# EAGLE schematic ATTiny10ProgrammingAdapter (EAGLE 6.4)
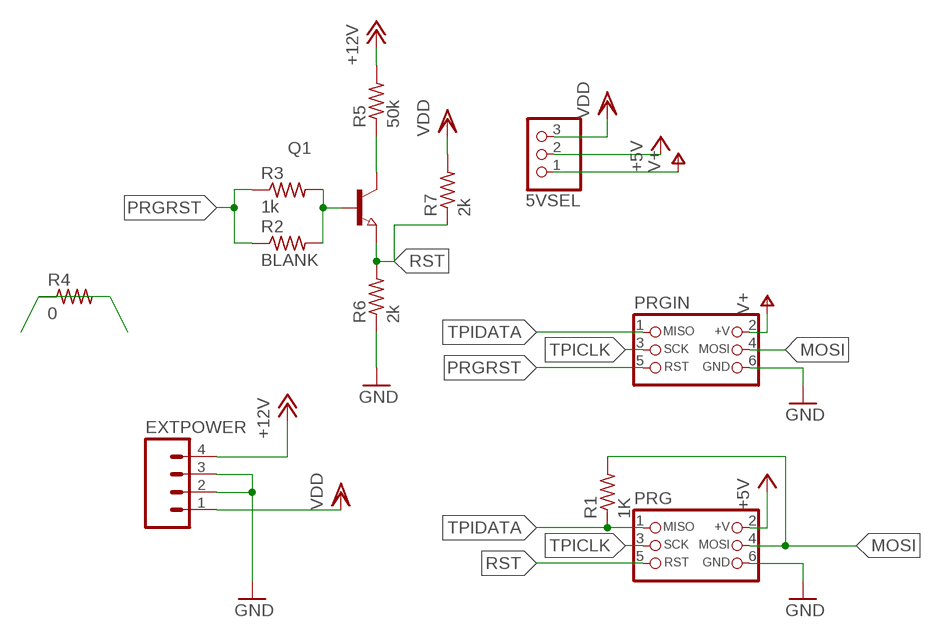
[diagram p0: schematic, sheet 1]

## Parts
5VSEL  PINHD-1X3CB  [1X03-CLEANBIG]
EXTPOWER  HEADER1X4SMD_LONGPADS  [1X04-SMD-LONG]
PRG  CON_HEADER_PRG_AVR_ICSP_ETCH  [HEADER_PRG_2X03_ETCH]
PRGIN  CON_HEADER_PRG_AVR_ICSP_ETCH  [HEADER_PRG_2X03_ETCH]
Q1  NPN-TRANSISTOR_SOT23  [SOT23]
R1  1K  R-US_R0805  [R0805]
R2  BLANK  R-US_R0805  [R0805]
R3  1k  R-US_R0805  [R0805]
R4  0  R-US_R1206  [R1206]
R5  50k  R-US_R0805  [R0805]
R6  2k  R-US_R0805  [R0805]
R7  2k  R-US_R0805  [R0805]

## Nets
+5V: 5VSEL.2 PRG.2(+V)
+12V: EXTPOWER.4 R4.1 R4.2 R5.2
GND: EXTPOWER.2 EXTPOWER.3 PRG.6(GND) PRGIN.6(GND) R6.1
MOSI: PRG.4(MOSI) PRGIN.4(MOSI) R1.2
N$1: Q1.1(B) R2.2 R3.2
N$4: Q1.3(C) R5.1
PRGRST: PRGIN.5(RST) R2.1 R3.1
RST: PRG.5(RST) Q1.2(E) R6.2 R7.1
TPICLK: PRG.3(SCK) PRGIN.3(SCK)
TPIDATA: PRG.1(MISO) PRGIN.1(MISO) R1.1
V+: 5VSEL.1 PRGIN.2(+V)
VDD: 5VSEL.3 EXTPOWER.1 R7.2

## Library data of the parts
5VSEL = adafruit:PINHD-1X3: PIN HEADER
EXTPOWER = LL:HEADER1X4: Header 4 Standard 4-pin 0.1" header. Modified from sparkfun for etch footprints
PRG PRGIN = LL:CON_HEADER_PRG_AVR_ICSP_ETCH: 2x3 AVR ICSP programming header for etching
Q1 = semicon-smd-ipc:NPN-TRANSISTOR_: NPN TRANSISTOR
R1 R4 = LL:R-US_: RESISTOR, American symbol
R2 R3 R5-R7 = adafruit:R-US_: RESISTOR, American symbol